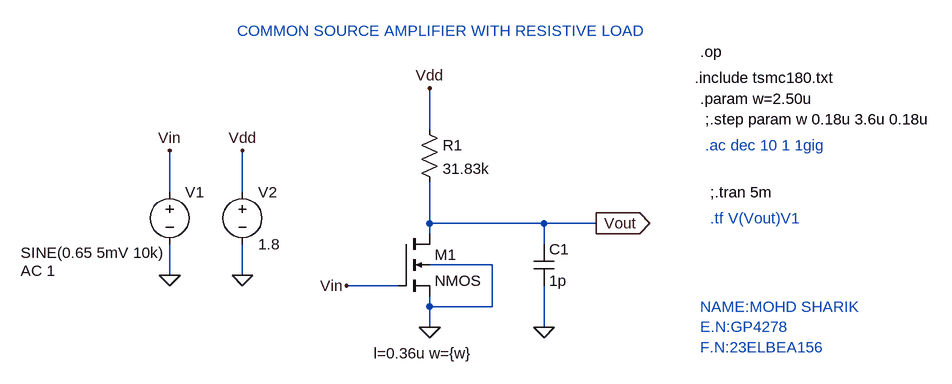
[diagram p0: schematic CSA_With_Resistive_Load Assignment.asc]
CSA_With_Resistive_Load Assignment.asc, the LTspice schematic file:
Version 4
SHEET 1 892 680
WIRE 48 -80 48 -144
WIRE -352 16 -352 -48
WIRE -240 16 -240 -48
WIRE 48 64 48 0
WIRE 224 64 48 64
WIRE 304 64 224 64
WIRE 48 80 48 64
WIRE 224 96 224 64
WIRE 144 128 48 128
WIRE -352 144 -352 96
WIRE -240 144 -240 96
WIRE 0 160 -80 160
WIRE 48 192 48 176
WIRE 144 192 144 128
WIRE 144 192 48 192
WIRE 48 224 48 192
WIRE 224 224 224 160
FLAG 48 224 0
FLAG 224 224 0
FLAG -80 160 Vin
FLAG 304 64 Vout
IOPIN 304 64 Out
FLAG 48 -144 Vdd
FLAG -240 144 0
FLAG -352 144 0
FLAG -352 -48 Vin
FLAG -240 -48 Vdd
SYMBOL nmos4 0 80 R0
WINDOW 123 -38 184 Left 2
SYMATTR InstName M1
SYMATTR Value2 l=0.36u w={w}
SYMBOL res 32 -96 R0
SYMATTR InstName R1
SYMATTR Value 31.83k
SYMBOL cap 208 96 R0
SYMATTR InstName C1
SYMATTR Value 1p
SYMBOL voltage -352 0 R0
WINDOW 3 -229 109 Left 2
WINDOW 123 -229 137 Left 2
WINDOW 39 0 0 Left 0
SYMATTR InstName V1
SYMATTR Value SINE(0.65 5mV 10k)
SYMATTR Value2 AC 1
SYMBOL voltage -240 0 R0
SYMATTR InstName V2
SYMATTR Value 1.8
TEXT 456 -160 Left 2 !.include tsmc180.txt
TEXT 464 -200 Left 2 !.op
TEXT 472 -96 Left 2 !;.step param w 0.18u 3.6u 0.18u
TEXT 464 -128 Left 2 !.param w=2.50u
TEXT 472 -56 Left 2 ;.ac dec 10 1 1gig
TEXT 480 16 Left 2 !;.tran 5m
TEXT 480 56 Left 2 ;.tf V(Vout)V1
TEXT 464 192 Left 2 ;NAME:MOHD SHARIK\nE.N:GP4278\nF.N:23ELBEA156
TEXT -248 -232 Left 2 ;COMMON SOURCE AMPLIFIER WITH RESISTIVE LOAD

The netlist it stands for:
* CSA_With_Resistive_Load Assignment.asc
M1 Vout Vin 0 0 NMOS l=0.36u w={w}
R1 Vdd Vout 31.83k
C1 Vout 0 1p
V1 Vin 0 SINE(0.65 5mV 10k) AC 1
V2 Vdd 0 1.8
.model NMOS NMOS
.model PMOS PMOS
.lib standard.mos
.include tsmc180.txt
.op
;.step param w 0.18u 3.6u 0.18u
.param w=2.50u
* .ac dec 10 1 1gig
;.tran 5m
* .tf V(Vout)V1
* NAME:MOHD SHARIK
* E.N:GP4278
* F.N:23ELBEA156
* COMMON SOURCE AMPLIFIER WITH RESISTIVE LOAD
.backanno
.end